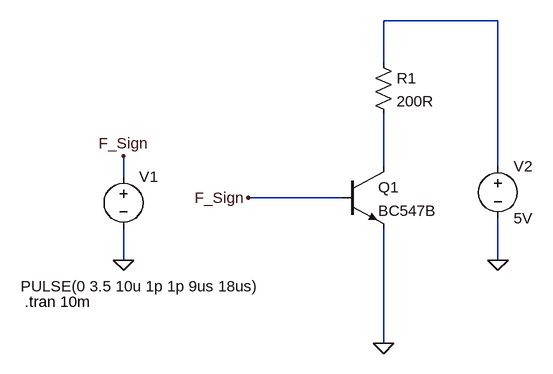
[diagram p0: schematic ltspace-polatization-TIL78.asc]
ltspace-polatization-TIL78.asc, the LTspice schematic file:
Version 4
SHEET 1 880 680
WIRE 464 -240 288 -240
WIRE 288 -176 288 -240
WIRE 288 -16 288 -96
WIRE 464 -16 464 -240
WIRE -112 0 -112 -32
WIRE 224 32 80 32
WIRE -112 128 -112 80
WIRE 464 128 464 64
WIRE 288 256 288 80
FLAG -112 -32 F_Sign
FLAG -112 128 0
FLAG 80 32 F_Sign
FLAG 464 128 0
FLAG 288 256 0
SYMBOL voltage -112 -16 R0
WINDOW 3 -158 184 Left 2
WINDOW 123 0 0 Left 0
WINDOW 39 0 0 Left 0
SYMATTR Value PULSE(0 3.5 10u 1p 1p 9us 18us)
SYMATTR InstName V1
SYMBOL voltage 464 -32 R0
WINDOW 123 0 0 Left 0
WINDOW 39 0 0 Left 0
SYMATTR InstName V2
SYMATTR Value 5V
SYMBOL res 272 -192 R0
SYMATTR InstName R1
SYMATTR Value 200R
SYMBOL npn 224 -16 R0
SYMATTR InstName Q1
SYMATTR Value BC547B
TEXT -264 192 Left 2 !.tran 10m

The netlist it stands for:
* ltspace-polatization-TIL78.asc
V1 F_Sign 0 PULSE(0 3.5 10u 1p 1p 9us 18us)
V2 N001 0 5V
R1 N001 N002 200R
Q1 N002 F_Sign 0 0 BC547B
.model NPN NPN
.model PNP PNP
.lib standard.bjt
.tran 10m
.backanno
.end